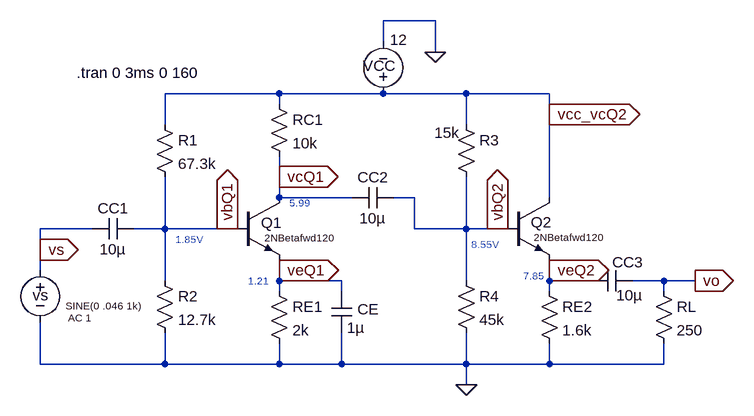
[diagram p0: schematic prob6_76cde.asc]
prob6_76cde.asc, the LTspice schematic file:
Version 4
SHEET 1 936 680
WIRE 416 -160 336 -160
WIRE 336 -128 336 -160
WIRE 416 -112 416 -160
WIRE 176 -48 0 -48
WIRE 336 -48 176 -48
WIRE 464 -48 336 -48
WIRE 592 -48 464 -48
WIRE 176 -32 176 -48
WIRE 592 -16 592 -48
WIRE 0 0 0 -48
WIRE 464 0 464 -48
WIRE 176 80 176 48
WIRE 176 112 176 80
WIRE 288 112 176 112
WIRE 384 112 352 112
WIRE 592 112 592 -16
WIRE -112 160 -192 160
WIRE 0 160 0 80
WIRE 0 160 -48 160
WIRE 96 160 0 160
WIRE 112 160 96 160
WIRE 384 160 384 112
WIRE 464 160 464 80
WIRE 464 160 384 160
WIRE 512 160 464 160
WIRE 528 160 512 160
WIRE -192 192 -192 160
WIRE -192 224 -192 192
WIRE 176 224 176 208
WIRE 592 224 592 208
WIRE 0 240 0 160
WIRE 176 240 176 224
WIRE 272 240 176 240
WIRE 464 240 464 160
WIRE 592 240 592 224
WIRE 656 240 592 240
WIRE 768 240 720 240
WIRE 816 240 768 240
WIRE 176 256 176 240
WIRE 272 256 272 240
WIRE 592 256 592 240
WIRE 768 256 768 240
WIRE -192 368 -192 304
WIRE 0 368 0 320
WIRE 0 368 -192 368
WIRE 176 368 176 336
WIRE 176 368 0 368
WIRE 272 368 272 320
WIRE 272 368 176 368
WIRE 464 368 464 320
WIRE 464 368 272 368
WIRE 592 368 592 336
WIRE 592 368 464 368
WIRE 768 368 768 336
WIRE 768 368 592 368
WIRE 464 400 464 368
FLAG 416 -112 0
FLAG 464 400 0
FLAG 816 240 vo
IOPIN 816 240 Out
FLAG 592 -16 vcc_vcQ2
IOPIN 592 -16 Out
FLAG 512 160 vbQ2
IOPIN 512 160 Out
FLAG 96 160 vbQ1
IOPIN 96 160 Out
FLAG 176 224 veQ1
IOPIN 176 224 Out
FLAG 176 80 vcQ1
IOPIN 176 80 Out
FLAG 592 224 veQ2
IOPIN 592 224 Out
FLAG -192 192 vs
IOPIN -192 192 Out
SYMBOL npn 112 112 R0
WINDOW 0 36 39 Left 2
WINDOW 3 41 62 Left 1
SYMATTR InstName Q1
SYMATTR Value 2NBetafwd120
SYMBOL npn 528 112 R0
WINDOW 0 35 38 Left 2
WINDOW 3 40 61 Left 1
SYMATTR InstName Q2
SYMATTR Value 2NBetafwd120
SYMBOL cap 352 96 R90
WINDOW 0 0 32 VBottom 2
WINDOW 3 32 32 VTop 2
SYMATTR InstName CC2
SYMATTR Value 10µ
SYMBOL res -16 -16 R0
SYMATTR InstName R1
SYMATTR Value 67.3k
SYMBOL res -16 224 R0
SYMATTR InstName R2
SYMATTR Value 12.7k
SYMBOL res 448 -16 R0
WINDOW 3 -33 28 Left 2
SYMATTR Value 15k
SYMATTR InstName R3
SYMBOL res 448 224 R0
SYMATTR InstName R4
SYMATTR Value 45k
SYMBOL res 160 -48 R0
SYMATTR InstName RC1
SYMATTR Value 10k
SYMBOL res 160 240 R0
SYMATTR InstName RE1
SYMATTR Value 2k
SYMBOL res 576 240 R0
SYMATTR InstName RE2
SYMATTR Value 1.6k
SYMBOL res 752 240 R0
SYMATTR InstName RL
SYMATTR Value 250
SYMBOL voltage 336 -32 R180
WINDOW 0 -19 59 Left 2
WINDOW 3 -37 99 Left 2
SYMATTR InstName VCC
SYMATTR Value 12
SYMBOL voltage -192 208 R0
WINDOW 0 -12 54 Left 2
WINDOW 3 39 70 Left 1
WINDOW 123 43 89 Left 1
WINDOW 39 0 0 Left 0
SYMATTR InstName vs
SYMATTR Value SINE(0 .046 1k)
SYMATTR Value2 AC 1
SYMBOL cap 256 256 R0
WINDOW 0 40 28 Left 2
SYMATTR InstName CE
SYMATTR Value 1µ
SYMBOL cap 720 224 R90
WINDOW 0 3 7 VBottom 2
WINDOW 3 23 5 VTop 2
SYMATTR InstName CC3
SYMATTR Value 10µ
SYMBOL cap -48 144 R90
WINDOW 0 0 32 VBottom 2
WINDOW 3 32 32 VTop 2
SYMATTR InstName CC1
SYMATTR Value 10µ
TEXT 16 176 Left 1 ;1.85V
TEXT 472 184 Left 1 ;8.55V
TEXT 192 120 Left 1 ;5.99
TEXT 128 240 Left 1 ;1.21
TEXT 552 232 Left 1 ;7.85
TEXT -136 -80 Left 2 !.tran 0 3ms 0 160

The netlist it stands for:
* prob6_76cde.asc
Q1 vcQ1 vbQ1 veQ1 0 2NBetafwd120
Q2 vcc_vcQ2 vbQ2 veQ2 0 2NBetafwd120
CC2 vbQ2 vcQ1 10µ
R1 vcc_vcQ2 vbQ1 67.3k
R2 vbQ1 0 12.7k
R3 vcc_vcQ2 vbQ2 15k
R4 vbQ2 0 45k
RC1 vcc_vcQ2 vcQ1 10k
RE1 veQ1 0 2k
RE2 veQ2 0 1.6k
RL vo 0 250
VCC vcc_vcQ2 0 12
vs vs 0 SINE(0 .046 1k) AC 1
CE veQ1 0 1µ
CC3 vo veQ2 10µ
CC1 vbQ1 vs 10µ
.model NPN NPN
.model PNP PNP
.lib standard.bjt
* 1.85V
* 8.55V
* 5.99
* 1.21
* 7.85
.tran 0 3ms 0 160
.backanno
.end